# Altium project RF_Shield_hv2.PrjPcb
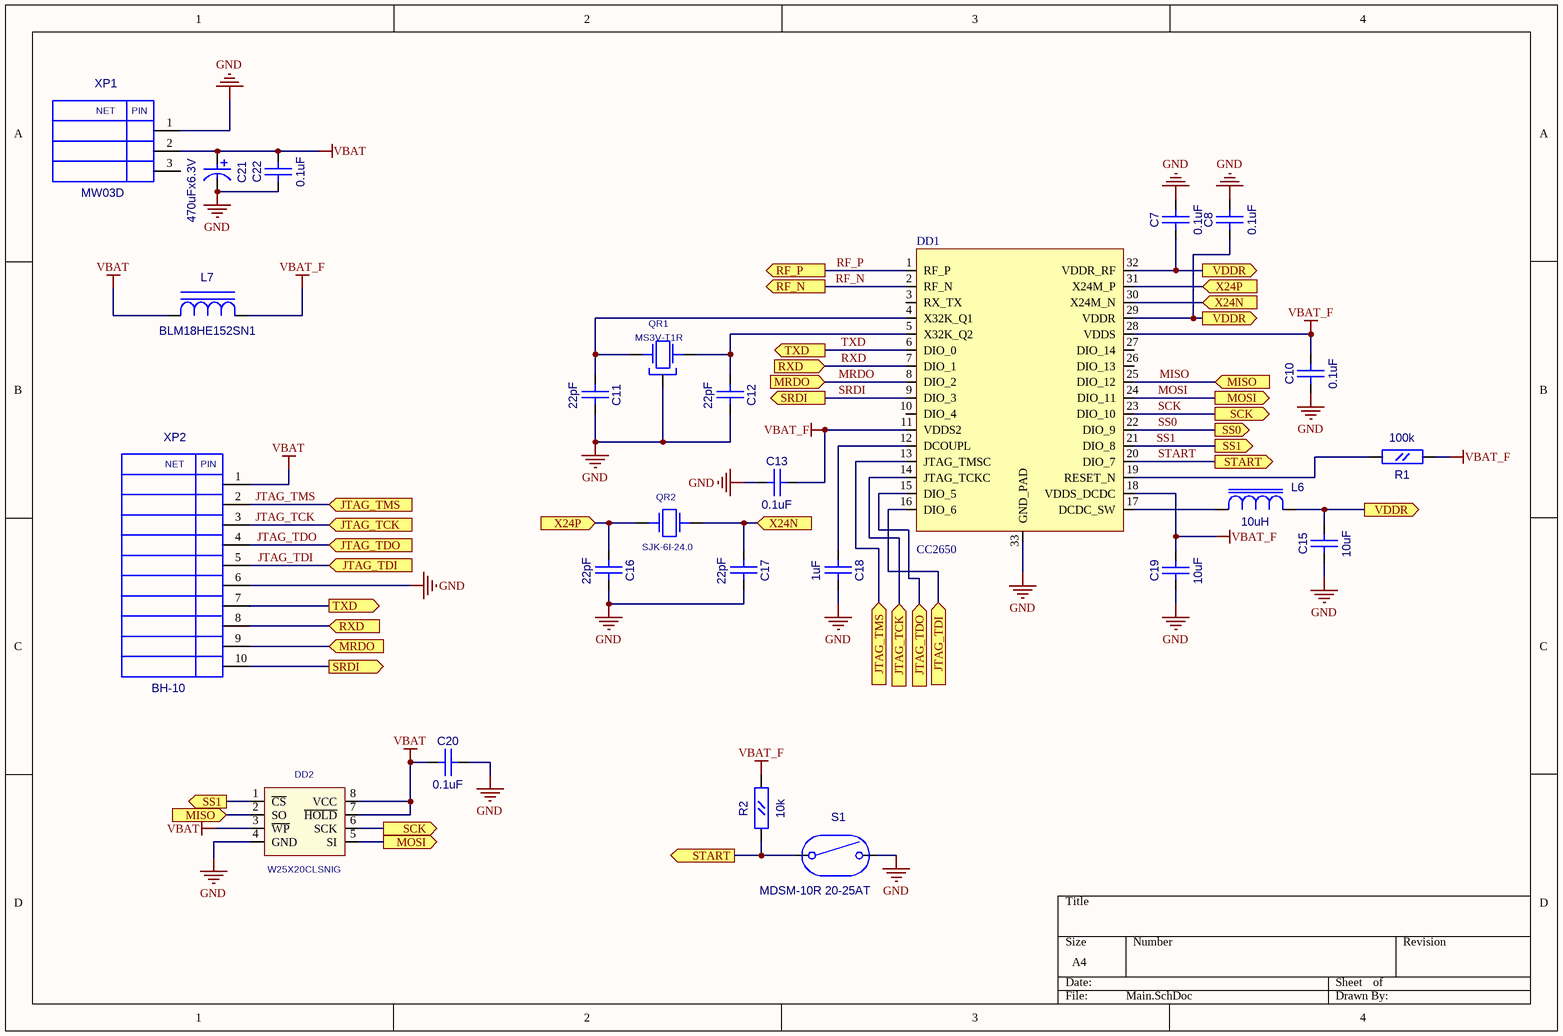
[diagram p0: Main.SchDoc]
3 sheets, 40 parts. Net scope: flat (ports and power ports of the same name join across sheets).
Board file: RF_Shield_hv2.PcbDoc
Sheets:
  Main.SchDoc
  RF.SchDoc
  Axel.SchDoc

## Sheet Main.SchDoc
size A4

### Parts
C7  0.1uF  [CC0603]
C8  0.1uF  [CC0603]
C10  0.1uF  [CC0603]
C11  22pF  [CC0603]
C12  22pF  [CC0603]
C13  0.1uF  [CC0603]
C15  10uF  [CC0805]
C16  22pF  [CC0603]
C17  22pF  [CC0603]
C18  1uF  [CC0603]
C19  10uF  [CC0805]
C20  0.1uF  [CC0603]
C21  470uFx6.3V  [TAJ-D-1M]
C22  0.1uF  [CC0603]
DD1  CC2650  [QFN32_TI]
DD2  W25X20CLSNIG  [EIAJ_SO8]
L6  10uH  [RC0805]
L7  BLM18HE152SN1  [L0603]
QR1  MS3V-T1R  [MS3V-T1R]
QR2  SJK-6I-24.0  [AC5032_2]
R1  100k  [RC0603]
R2  10k  [RC0603]
S1  MDSM-10R 20-25AT  [MDSM-10R]
XP1  MW03D  [MW03D]
XP2  BH-10  [BH-10]

### Ports
JTAG_TCK (in), JTAG_TDI (in), JTAG_TDO (in), JTAG_TMS (in), MISO (in), MOSI (out), MRDO (in), RF_N (out), RF_P (out), RXD (in), SCK (out), SRDI (out), SS0 (out), SS1 (out), START (out), TXD (out), VDDR (out), X24N (in), X24P (in)

### Nets
GND: C7.2(B) C8.2(B) C10.1(A) C11.2(B) C12.2(B) C13.1(A) C15.1(A) C16.2(B) C17.2(B) C18.2(B) C19.1(A) C20.2(B) C21.2(B) C22.1(A) DD1.33(GND_PAD) DD2.4(GND) QR1.3 S1.2 XP1.1 XP2.6
VBAT: C20.1(A) C21.1(A) C22.2(B) DD2.3(~{WP}) DD2.7(~{HOLD}) DD2.8(VCC) L7.1(A) XP1.2 XP2.1
VBAT_F: C10.2(B) C13.2(B) C19.2(B) DD1.11(VDDS2) DD1.18(VDDS_DCDC) DD1.28(VDDS) L7.2(C) R1.1(A) R2.2(B)
JTAG_TCK: DD1.14(JTAG_TCKC) XP2.3 ; port JTAG_TCK
JTAG_TDI: DD1.16(DIO_6) XP2.5 ; port JTAG_TDI
JTAG_TDO: DD1.15(DIO_5) XP2.4 ; port JTAG_TDO
JTAG_TMS: DD1.13(JTAG_TMSC) XP2.2 ; port JTAG_TMS
MISO: DD1.25(DIO_12) DD2.2(SO) ; port MISO
MOSI: DD1.24(DIO_11) DD2.5(SI) ; port MOSI
MRDO: DD1.8(DIO_2) XP2.9 ; port MRDO
RF_N: DD1.2(RF_N) ; port RF_N
RF_P: DD1.1(RF_P) ; port RF_P
RXD: DD1.7(DIO_1) XP2.8 ; port RXD
SCK: DD1.23(DIO_10) DD2.6(SCK) ; port SCK
SRDI: DD1.9(DIO_3) XP2.10 ; port SRDI
SS0: DD1.22(DIO_9) ; port SS0
SS1: DD1.21(DIO_8) DD2.1(~{CS}) ; port SS1
START: DD1.20(DIO_7) R2.1(A) S1.1 ; port START
TXD: DD1.6(DIO_0) XP2.7 ; port TXD
NetC7_1: C7.1(A) C8.1(A) C15.2(B) DD1.29(VDDR) DD1.32(VDDR_RF) L6.2(B) ; port VDDR
NetC11_1: C11.1(A) DD1.4(X32K_Q1) QR1.2(X2)
NetC12_1: C12.1(A) DD1.5(X32K_Q2) QR1.1(X1)
NetC16_1: C16.1(A) DD1.31(X24M_P) QR2.1 ; port X24P
NetC17_1: C17.1(A) DD1.30(X24M_N) QR2.2 ; port X24N
NetC18_1: C18.1(A) DD1.12(DCOUPL)
NetDD1_17: DD1.17(DCDC_SW) L6.1(A)
NetDD1_19: DD1.19(RESET_N) R1.2(B)

Not connected (* = marked no-connect by the designer): DD1 3(RX_TX) 10(DIO_4) 26(DIO_13) 27(DIO_14); XP1 3

### Notes on the sheet
- (in symbol BH-10) NET; PIN
- (in symbol MW03D) NET; PIN

### Library data of the parts
C7 C8 C10-C13 C16-C18 C20 C22 = CC0603
  C7 C8 C10 C13 C20 C22: Value: 0.1uF
  C11 C12 C16 C17: Value: 22pF
  C18: Value: 1uF
C15 C19 = CC0805: Value: 10uF
C21 = TAJ-D: Value: 470uFx6.3V
DD1 = CC2650RHB: CC2650RHBT; Value: CC2650
DD2 = S25FL016A0LMFI01: Value: W25X20CLSNIG
L6 = L0805: Value: 10uH
L7 = L0603: Value: BLM18HE152SN1
QR1 = MS3V-T1R: CRYSTAL_32768 Hz; Value: *
QR2 = AC5032_2: AC5032/2; Value: SJK-6I-24.0
R1 R2 = RC0603
  R1: Value: 100k
  R2: Value: 10k
S1 = MDSM-10R: Switch, Single Pole, Single Throw, Normally Open; Value: {Value}
XP1 = MW03D: Value: *
XP2 = BH-10: Value: *

## Sheet RF.SchDoc
size A4
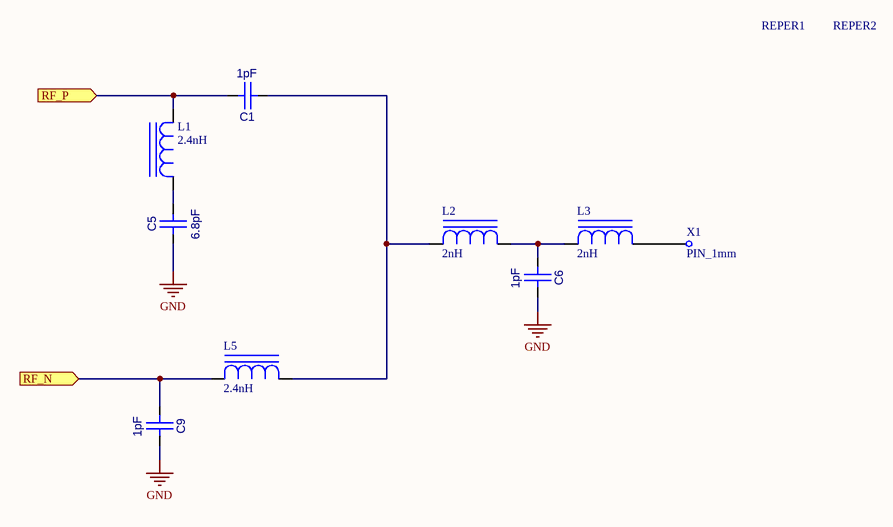
[diagram p1: RF.SchDoc]

### Parts
C1  1pF  [CC0603]
C5  6.8pF  [CC0603]
C6  1pF  [CC0603]
C9  1pF  [CC0603]
L1  2.4nH  [L0402]
L2  2nH  [L0402]
L3  2nH  [L0402]
L5  2.4nH  [L0402]
REPER1  REPER1.2  [REPER1.2]  (value not drawn)
REPER2  REPER1.2  [REPER1.2]  (value not drawn)
X1  PIN_1mm  [PIN_1mm]

### Ports
RF_N (in), RF_P (in)

### Nets
GND: C5.1(A) C6.2(B) C9.2(B)
RF_N: C9.1(A) L5.1(A) ; port RF_N
RF_P: C1.2(B) L1.2(C) ; port RF_P
NetC1_1: C1.1(A) L2.1(A) L5.2(C)
NetC5_2: C5.2(B) L1.1(A)
NetC6_1: C6.1(A) L2.2(C) L3.1(A)
NetL3_2: L3.2(C) X1.1

Not connected (* = marked no-connect by the designer): REPER1 1; REPER2 1

### Library data of the parts
C1 C5 C6 C9 = CC0603
  C1 C6 C9: Value: 1pF
  C5: Value: 6.8pF
L1-L3 L5 = L0402
  L1 L5: Value: 2.4nH
  L2 L3: Value: 2nH
REPER1 REPER2 = REPER1.2: Value: *

## Sheet Axel.SchDoc
size A4
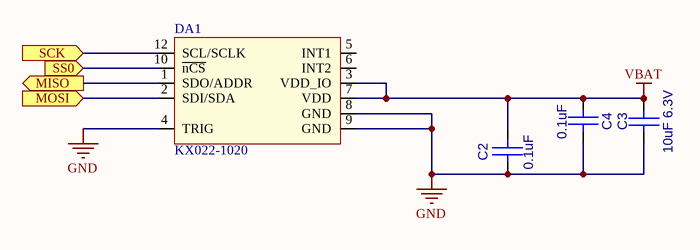
[diagram p2: Axel.SchDoc]

### Parts
C2  0.1uF  [CC0603]
C3  10uF 6.3V  [CC0805]
C4  0.1uF  [CC0603]
DA1  KX022-1020  [LGA-12]

### Ports
MISO (out), MOSI (in), SCK (in), SS0 (in)

### Nets
GND: C2.2(B) C3.1(A) C4.2(B) DA1.4(TRIG) DA1.8(GND) DA1.9(GND)
VBAT: C2.1(A) C3.2(B) C4.1(A) DA1.3(VDD_IO) DA1.7(VDD)
MISO: DA1.1(SDO/ADDR) ; port MISO
MOSI: DA1.2(SDI/SDA) ; port MOSI
SCK: DA1.12(SCL/SCLK) ; port SCK
SS0: DA1.10(~{nCS}) ; port SS0

Not connected (* = marked no-connect by the designer): DA1 5(INT1) 6(INT2)

### Library data of the parts
C2 C4 = CC0603: Value: 0.1uF
C3 = CC0805: Value: 10uF 6.3V
DA1 = KX022-1020: Value: KX022-1020

## Nets that join several sheets
GND: Main (20 pins), RF (C5.1 C6.2 C9.2), Axel (6 pins)
VBAT: Main (9 pins), Axel (5 pins)
MISO: Main (DD1.25 DD2.2), Axel (DA1.1)
MOSI: Main (DD1.24 DD2.5), Axel (DA1.2)
RF_N: Main (DD1.2), RF (C9.1 L5.1)
RF_P: Main (DD1.1), RF (C1.2 L1.2)
SCK: Main (DD1.23 DD2.6), Axel (DA1.12)
SS0: Main (DD1.22), Axel (DA1.10)